# Altium schematic sheet PCB2_Schematic.SchDoc
size A4; SheetNumber: 1; SheetTotal: 3
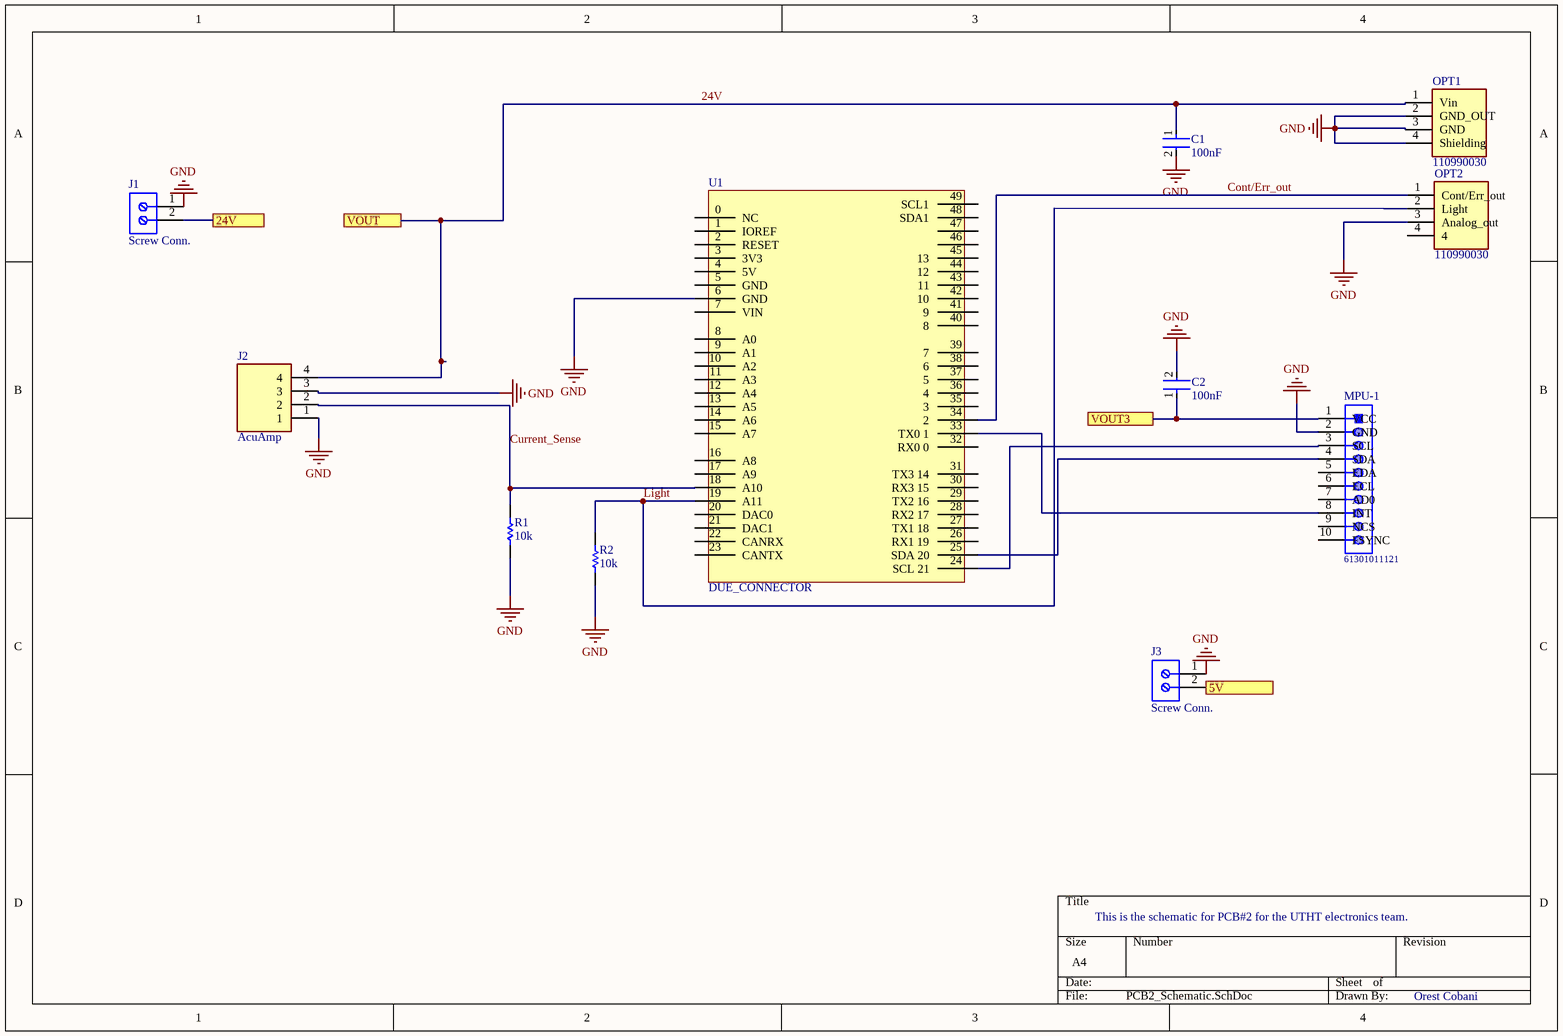
[diagram p0: PCB2_Schematic.SchDoc]

## Parts
C1  Capacitance: 100nF  [FP-C0603-CJ-MFG]  (hidden comment: C0603X104K5RACTU)
C2  Capacitance: 100nF  [FP-C0603-CJ-MFG]  (hidden comment: C0603X104K5RACTU)
J1  Screw Conn.  [PHOE-1714955_V]
J2  AcuAmp  [SEEED_110990030]
J3  Screw Conn.  [PHOE-1714955_V]
MPU-1  61301011121  [61301011121]
OPT1  110990030  [SEEED_110990030]
OPT2  110990030  [SEEED_110990030]
R1  Resistance (Ohms): 10k  [OMTE-RES7X2.5-2]  (hidden comment: OD103JE)
R2  Resistance (Ohms): 10k  [OMTE-RES7X2.5-2]  (hidden comment: OD103JE)
U1  DUE_CONNECTOR  [DUE_FOOTPRINT]

## Ports
5V, 24V, VOUT, VOUT3

## Nets
GND: C1.2 C2.2 J1.1 J2.1 J2.3 J3.1 MPU-1.2(GND) OPT1.2(GND_OUT) OPT1.3(GND) OPT1.4(Shielding) OPT2.3(Analog_out) R1.1 R2.1 U1.6(GND)
5V: J3.2 ; port 5V
24V: C1.1 J2.4 OPT1.1(Vin) ; port VOUT
24V: J1.2 ; port 24V  [a separate net that carries the same name]
Cont/Err_out: OPT2.1(Cont/Err_out) U1.34(2)
Current_Sense: J2.2 R1.2 U1.18(A10)
Light: OPT2.2(Light) R2.2 U1.19(A11)
VOUT3: C2.1 MPU-1.1(VCC) ; port VOUT3
NetMPU-1_3: MPU-1.3(SCL) U1.24(SCL_21)
NetMPU-1_4: MPU-1.4(SDA) U1.25(SDA_20)
NetMPU-1_8: MPU-1.8(INT) U1.33(TX0_1)

Not connected (* = marked no-connect by the designer): MPU-1 5(EDA) 6(ECL) 7(AD0) 9(NCS) 10(FSYNC); OPT2 4; U1 0(NC) 1(IOREF) 2(RESET) 3(3V3) 4(5V) 5(GND) 7(VIN) 8(A0) 9(A1) 10(A2) 11(A3) 12(A4) 13(A5) 14(A6) 15(A7) 16(A8) 17(A9) 20(DAC0) 21(DAC1) 22(CANRX) 23(CANTX) 26(RX1_19) 27(TX1_18) 28(RX2_17) 29(TX2_16) 30(RX3_15) 31(TX3_14) 32(RX0_0) 35(3) 36(4) 37(5) 38(6) 39(7) 40(8) 41(9) 42(10) 43(11) 44(12) 45(13) 46 47 48(SDA1) 49(SCL1)

## Notes on the sheet
- This is the schematic for PCB#2 for the UTHT electronics team.
- Orest Cobani

## Library data of the parts
C1 C2 = CMP-2006-03300-2: CAP CER 0.1UF 50V X7R 0603; Manufacturer: Kemet; Material: Ceramic; Tolerance: 10%; Value: 100nF; Temperature Coefficient: 15%; Temperature Range High: +125°C; Temperature Range Low: -55°C; Manufacturer Part Number: C0603X104K5RACTU; Voltage: 50V; ComponentLink2Description: Datasheet; RoHS: TRUE; ComponentLink2URL: https://content.kemet.com/datasheets/KEM_C1013_X7R_FT-CAP_SMD.pdf; Device Class L3: Ceramic Capacitors; Device Class L2: Capacitors; Package: C0603-CJ; Height: 0.95mm; Device Class L1: Passive Components; Temperature Characteristic: X7R; Lead Free: Yes; Digikey Description: CAP CER 0.1UF 50V X7R 0603; Automotive: No; Mouser Description: Capacitor; Ceramic; Cap 0.1uF; Tol+10%; SMT; Flexible Termination; Vol-Rtg 50V; TR; Temperature: -55°C to +125°C; Octopart: https://octopart.com/c0603x104k5ractu-kemet-9145062; Category: Cap; Voltage Rating: 50V; Ipc Land Pattern Name: CAPC16080X80
J1 J3 = CMP-2000-05797-1: PC Terminal Block, Pitch 6.35 mm, 1 x 2 Position, Height 21.5 mm, Tail Lenght 5.1 mm, RoHS, Bulk; Manufacturer: Phoenix Contact; Package Description: PC Terminal Block, Pitch 6.35 mm, 1 x 2 Position, Height 21.5 mm, Tail Lenght 5.1 mm; Datasheet URL: http://media.digikey.com/pdf/Data%20Sheets/Phoenix%20Contact%20PDFs/1714955.pdf; Package Reference: 1714955; Manufacturer URL: http://www.phoenixcontact.com/; Datasheet Version: 02/2010; Mounting Technology: ThroughHole
J2 OPT1 OPT2 = 110990030: GROVE 2MM 4PIN VERT CONN 10PCS; MF: Seeed Technology; Arrow_Electronics-Purchase-URL: https://snapeda.com/shop?store=Arrow+Electronics&id=583576; Availability: Good; Package: None; Price: None; Mouser-Purchase-URL: https://snapeda.com/shop?store=Mouser&id=583576; MP: 110990030; SnapEDA_Link: https://www.snapeda.com/parts/110990030/Seeed%20Technology%20Co.,%20Ltd/view-part/583576/?ref=snap; Value: *; Check_prices: https://www.snapeda.com/parts/110990030/Seeed%20Technology%20Co.,%20Ltd/view-part/583576/?ref=eda
MPU-1 = CMP-1502-01082-1: THT Vertical Pin Header WR-PHD, Pitch 2.54 mm, Single Row, 10 pins; Manufacturer: Wurth Elektronik; Contact Resistance: 20mOhm; Rated Current: 3A; Pitch: 2.54mm; Gender: Male; Pin Number: 10; Working Voltage: 250VAC; Withstanding Voltage: 500VAC; Manufacturer URL: http://www.we-online.de; Operating Temperature: -40to105degC; Datasheet URL: https://katalog.we-online.de/em/datasheet/6130xx11121.pdf; Row Number: Single; Orientation: Vertical; Part Number: 61301011121; Packaging: Bag; Package Reference: 61301011121; Mounting Technology: THT; Publisher: WurthElektronik
R1 R2 = CMP-2000-06865-1: Little Demon(R) Carbon Composition Molded OD Series, 250 V, 10 KOhm, +/-5%, -70 to 130 degC, 2-Pin THD, RoHS, Bulk; Manufacturer: Ohmite; Power Rating: 0.25W; Power (Watts): 0.25W,1/4W; Tolerance: ±5%; Online Catalog: OD,OF,OASeries,LittleDemon®; Catalog Drawings: OD,OF,OASeries; EDA / CAD Models: DownloadfromAcceleratedDesigns; Mounting Technology: ThroughHole; Datasheet Version: 06/2016; RoHS Information: LittleDemon"E"SeriesMaterialDeclaration; Number of Terminations: 2; Temperature Coefficient: -; Height: -; Composition: CarbonComposition; Package Description: 2-Pin THD Resistor, Body 7 x 2.5 mm, Lead Dia. 0.6 mm; Size / Dimension: 0.098"Diax0.276"L(2.50mmx7.00mm); Category: Resistors; Manufacturer URL: http://www.ohmite.com/; Features: PulseWithstanding; Family: ThroughHoleResistors; PartNumber: OD103JE; Supplier Device Package: Axial; Package / Case: Axial; Standard Package: 100; Package Reference: RES7X2.5; Operating Temperature: -; Series: LittleDemon®OD; Datasheet URL: http://www.ohmite.com/cat/res_od_of_oa.pdf; Packaging: Bulk